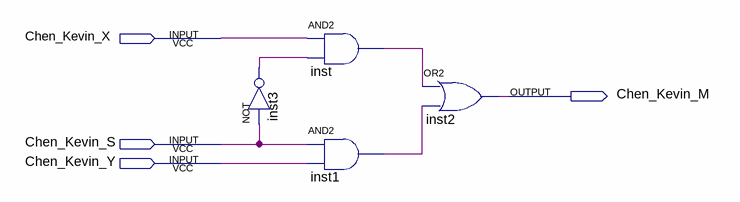
[diagram p0: schematic sheet]
// Quartus schematic Chen_Kevin_Mux2to1.bdf as structural Verilog: 4 symbols, 4 pins
module Chen_Kevin_Mux2to1 (
  input  Chen_Kevin_X,
  input  Chen_Kevin_S,
  input  Chen_Kevin_Y,
  output Chen_Kevin_M
);

  wire inst1_out, inst3_out, inst_out;

  not inst3 (inst3_out, Chen_Kevin_S);
  and inst (inst_out, Chen_Kevin_X, inst3_out);
  and inst1 (inst1_out, Chen_Kevin_S, Chen_Kevin_Y);
  or inst2 (Chen_Kevin_M, inst_out, inst1_out);
endmodule
